# Altium schematic sheet LoRa.SchDoc: =ProjectName
size A4; CheckedBy: DatNB; Author: Ven; CompanyName: Nacentech; Organization: IMET
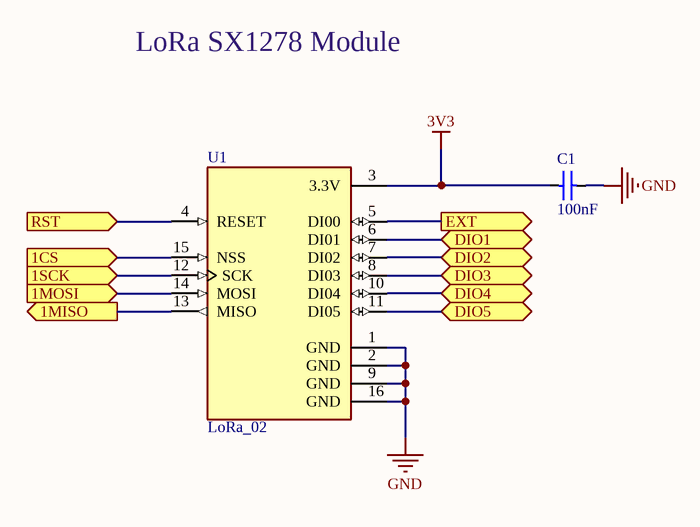
[diagram p0: LoRa.SchDoc]

## Parts
C1  100nF  [CAP_0805]
U1  LoRa_02  [Ra-02]

## Ports
1CS (in), 1MISO (out), 1MOSI (in), 1SCK (in), DIO1 (bidir), DIO2 (bidir), DIO3 (bidir), DIO4 (bidir), DIO5 (bidir), EXT (out), RST (in)

## Nets
3V3: C1.1 U1.3(3.3V)
GND: C1.2 U1.1(GND) U1.2(GND) U1.9(GND) U1.16(GND)
1CS: U1.15(NSS) ; port 1CS
1MISO: U1.13(MISO) ; port 1MISO
1MOSI: U1.14(MOSI) ; port 1MOSI
1SCK: U1.12(SCK) ; port 1SCK
DIO1: U1.6(DI01) ; port DIO1
DIO2: U1.7(DI02) ; port DIO2
DIO3: U1.8(DI03) ; port DIO3
DIO4: U1.10(DI04) ; port DIO4
DIO5: U1.11(DI05) ; port DIO5
EXT: U1.5(DI00) ; port EXT
RST: U1.4(RESET) ; port RST

## Notes on the sheet
- LoRa SX1278 Module
- Project:
- Page Contents:
- Size:
- Date:
- A4
- Checked by:
- Time:
- Revision:
- Sheet
- of
- File:

## Library data of the parts
C1 = CapSMD: Capacitor; Value: 33p; Published: 8-Jun-2000; LatestRevisionDate: 17-Jul-2002; LatestRevisionNote: Re-released for DXP Platform.; PackageReference: RAD-0.3; Publisher: Altium Limited